# Altium project slaves.PrjPCB
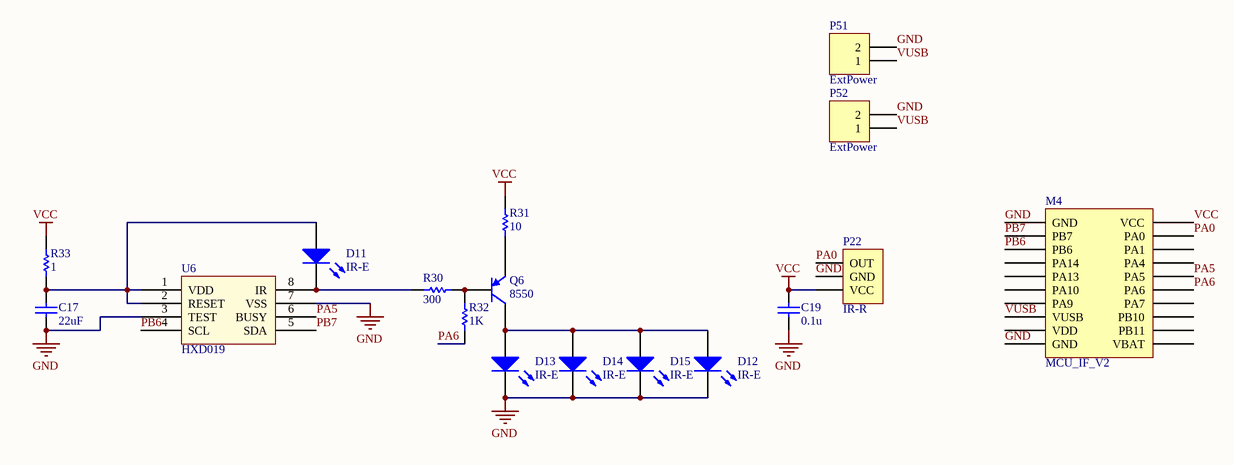
[diagram p0: IR.SchDoc]
7 sheets, 71 parts. Net scope: global (net labels, ports and power ports of the same name join across sheets).
Board file: slaves.PcbDoc
Sheets:
  IR.SchDoc
  sensors.SchDoc
  relay.SchDoc
  battery.SchDoc
  debug.SchDoc
  gp2y1010.SchDoc
  rs485.SchDoc

## Sheet IR.SchDoc
size A4

### Parts
C17  value 22uF  [C-2012[0805]]  (hidden comment: Cap Semi)
C19  value 0.1u  [C-1608[0603]]  (hidden comment: Cap Semi)
D11  IR-E  [PIN2]
D12  IR-E  [PIN2]
D13  IR-E  [PIN2]
D14  IR-E  [PIN2]
D15  IR-E  [PIN2]
M4  MCU_IF_V2  [MCU_IF_V2]
P22  IR-R  [HDR1X3]
P51  ExtPower  [HDR1X2H]
P52  ExtPower  [HDR1X2H]
Q6  8550  [SOT-23B]
R30  value 300  [R-1608[0603]]  (hidden comment: Res Semi)
R31  value 10  [R-2012[0805]]  (hidden comment: Res Semi)
R32  value 1K  [R-1608[0603]]  (hidden comment: Res Semi)
R33  value 1  [R-2012[0805]]  (hidden comment: Res Semi)
U6  HXD019  [SOP8]

### Nets
GND: C17.2 C19.1 D12.2(K) D13.2(K) D14.2(K) D15.2(K) M4.1(GND) M4.10(GND) P22.2(GND) P51.2 P52.2 U6.3(TEST) U6.7(VSS)
VCC: C19.2 M4.20(VCC) P22.3(VCC) R31.1 R33.1
VUSB: M4.8(VUSB) P51.1 P52.1
PA0: M4.19(PA0) P22.1(OUT)
PA5: M4.16(PA5) U6.6(BUSY)
PA6: M4.15(PA6) R32.1
PB6: M4.3(PB6) U6.4(SCL)
PB7: M4.2(PB7) U6.5(SDA)
NetC17_1: C17.1 D11.1(A) R33.2 U6.1(VDD) U6.2(RESET)
NetD11_2: D11.2(K) R30.1 U6.8(IR)
NetD12_1: D12.1(A) D13.1(A) D14.1(A) D15.1(A) Q6.1(C)
NetQ6_2: Q6.2(B) R30.2 R32.2
NetQ6_3: Q6.3(E) R31.2

Not connected (* = marked no-connect by the designer): M4 4(PA14) 5(PA13) 6(PA10) 7(PA9) 9(VDD) 11(VBAT) 12(PB11) 13(PB10) 14(PA7) 17(PA4) 18(PA1)

### Library data of the parts
C17 C19 = Cap Semi: Capacitor (Semiconductor SIM Model); Published: 8-Jun-2000; PackageReference: C1206; Publisher: Altium Limited
  C17: LatestRevisionDate: 29-May-2009; LatestRevisionNote: IPC-7351 Footprint Added.; PackageDescription: Chip Capacitor
  C19: LatestRevisionDate: 17-Jul-2002; LatestRevisionNote: Re-released for DXP Platform.
D11-D15 = LED0: Typical INFRARED GaAs LED; Published: 8-Jun-2000; LatestRevisionDate: 08-Jul-2005; LatestRevisionNote: Mech Layer 1 removed.; PackageReference: LED-0; Publisher: Altium Limited
M4 = MCU_IF_V1
P22 = IR: Header, 3-Pin; LatestRevisionDate: 17-Jul-2002; LatestRevisionNote: Re-released for DXP Platform.; Publisher: Altium Limited
P51 P52 = Header 2H: Header, 2-Pin, Right Angle; LatestRevisionDate: 17-Jul-2002; LatestRevisionNote: Re-released for DXP Platform.; Publisher: Altium Limited
Q6 = PNP: PNP Bipolar Transistor; pin to pad: 1>3 2>1 3>2; Published: 8-Jun-2000; LatestRevisionDate: 17-Jul-2002; LatestRevisionNote: Re-released for DXP Platform.; PackageReference: SOT-23B; Publisher: Altium Limited; Code_JEDEC: SOT-23
R30-R33 = Res Semi: Semiconductor Resistor; Published: 8-Jun-2000; LatestRevisionDate: 17-Jul-2002; LatestRevisionNote: Re-released for DXP Platform.; PackageReference: AXIAL-0.5; Publisher: Altium Limited

## Sheet sensors.SchDoc
size A4
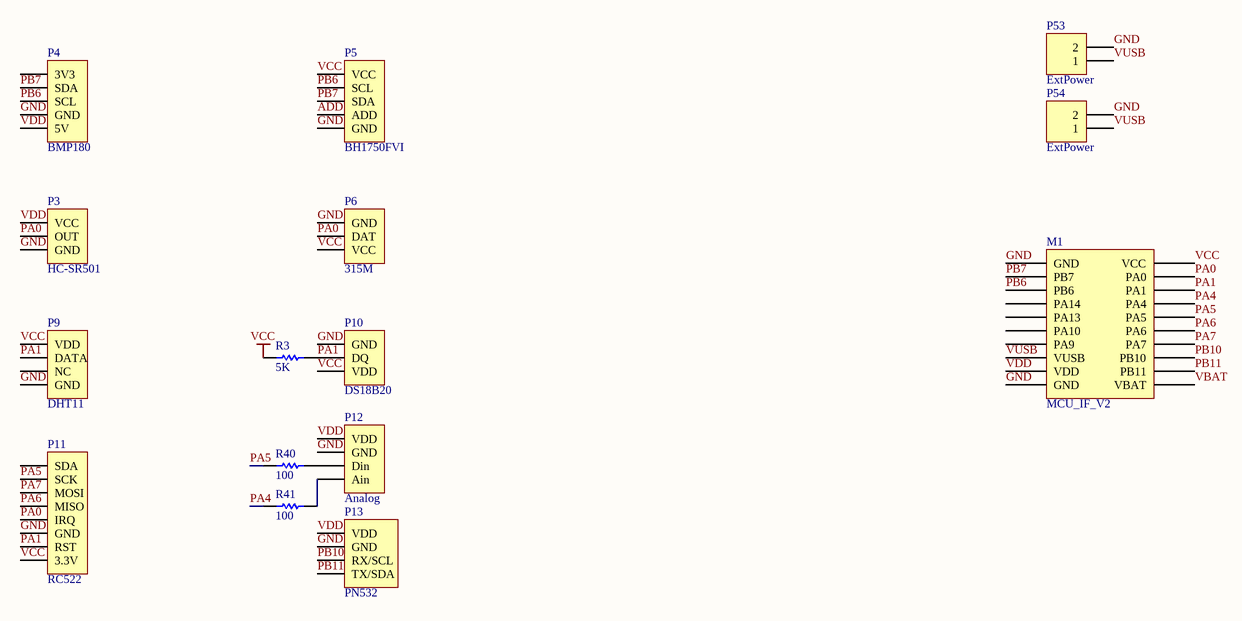
[diagram p1: sensors.SchDoc]

### Parts
M1  MCU_IF_V2  [MCU_IF_V2]
P3  HC-SR501  [HDR1X3]
P4  BMP180  [HDR1X5]
P5  BH1750FVI  [HDR1X5]
P6  315M  [HDR1X3]
P9  DHT11  [HDR1X4]
P10  DS18B20  [HDR1X3]
P11  RC522  [HDR1X8]
P12  Analog  [HDR1X4]
P13  PN532  [HDR1X4]
P53  ExtPower  [HDR1X2H]
P54  ExtPower  [HDR1X2H]
R3  value 5K  [R-1608[0603]]  (hidden comment: Res Semi)
R40  value 100  [R-1608[0603]]  (hidden comment: Res Semi)
R41  value 100  [R-1608[0603]]  (hidden comment: Res Semi)

### Nets
GND: M1.1(GND) M1.10(GND) P3.3(GND) P4.4(GND) P5.5(GND) P6.1(GND) P9.4(GND) P10.1(GND) P11.6(GND) P12.2(GND) P13.2(GND) P53.2 P54.2
VBAT: M1.11(VBAT)
VCC: M1.20(VCC) P5.1(VCC) P6.3(VCC) P9.1(VDD) P10.3(VDD) P11.8(3.3V) R3.1
VDD: M1.9(VDD) P3.1(VCC) P4.5(5V) P12.1(VDD) P13.1(VDD)
VUSB: M1.8(VUSB) P53.1 P54.1
ADD: P5.4(ADD)
PA0: M1.19(PA0) P3.2(OUT) P6.2(DAT) P11.5(IRQ)
PA1: M1.18(PA1) P9.2(DATA) P10.2(DQ) P11.7(RST) R3.2
PA4: M1.17(PA4) R41.1
PA5: M1.16(PA5) P11.2(SCK) R40.1
PA6: M1.15(PA6) P11.4(MISO)
PA7: M1.14(PA7) P11.3(MOSI)
PB6: M1.3(PB6) P4.3(SCL) P5.2(SCL)
PB7: M1.2(PB7) P4.2(SDA) P5.3(SDA)
PB10: M1.13(PB10) P13.3(RX/SCL)
PB11: M1.12(PB11) P13.4(TX/SDA)
NetP12_3: P12.3(Din) R40.2
NetP12_4: P12.4(Ain) R41.2

Not connected (* = marked no-connect by the designer): M1 4(PA14) 5(PA13) 6(PA10) 7(PA9); P4 1(3V3); P9 3(NC); P11 1(SDA)

### Library data of the parts
M1 = MCU_IF_V1
P3 = HC-SR501: Header, 3-Pin; LatestRevisionDate: 17-Jul-2002; LatestRevisionNote: Re-released for DXP Platform.; Publisher: Altium Limited
P4 = BMP180: Header, 5-Pin; LatestRevisionDate: 17-Jul-2002; LatestRevisionNote: Re-released for DXP Platform.; Publisher: Altium Limited
P6 = 315M: Header, 3-Pin; LatestRevisionDate: 17-Jul-2002; LatestRevisionNote: Re-released for DXP Platform.; Publisher: Altium Limited
P9 = DHT11: Header, 4-Pin; LatestRevisionDate: 17-Jul-2002; LatestRevisionNote: Re-released for DXP Platform.; Publisher: Altium Limited
P10 = DS18B20: Header, 3-Pin; LatestRevisionDate: 17-Jul-2002; LatestRevisionNote: Re-released for DXP Platform.; Publisher: Altium Limited
P11 = RC522: Header, 8-Pin; LatestRevisionDate: 17-Jul-2002; LatestRevisionNote: Re-released for DXP Platform.; Publisher: Altium Limited
P12 = Analog: Header, 4-Pin; LatestRevisionDate: 17-Jul-2002; LatestRevisionNote: Re-released for DXP Platform.; Publisher: Altium Limited
P13 = PN532: Header, 4-Pin; LatestRevisionDate: 17-Jul-2002; LatestRevisionNote: Re-released for DXP Platform.; Publisher: Altium Limited
P53 P54 = Header 2H: Header, 2-Pin, Right Angle; LatestRevisionDate: 17-Jul-2002; LatestRevisionNote: Re-released for DXP Platform.; Publisher: Altium Limited
R3 R40 R41 = Res Semi: Semiconductor Resistor; Published: 8-Jun-2000; LatestRevisionDate: 17-Jul-2002; LatestRevisionNote: Re-released for DXP Platform.; PackageReference: AXIAL-0.5; Publisher: Altium Limited
P5 = BH1750FVI: LatestRevisionDate: 17-Jul-2002; LatestRevisionNote: Re-released for DXP Platform.; Publisher: Altium Limited

## Sheet relay.SchDoc
size A4
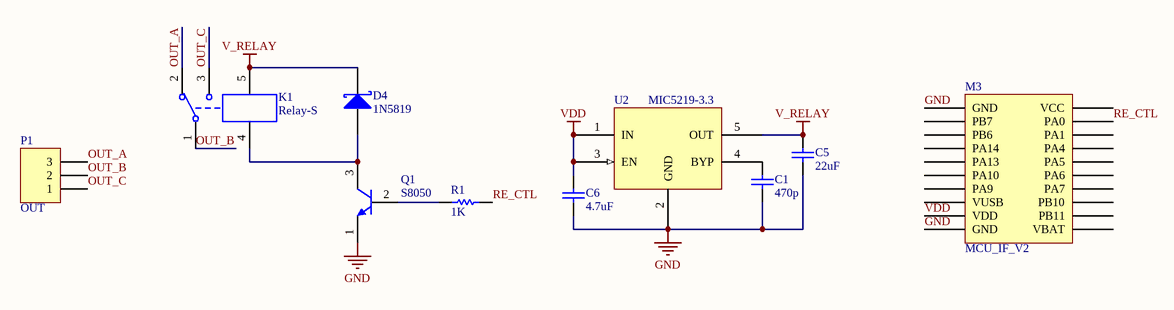
[diagram p2: relay.SchDoc]

### Parts
C1  value 470p  [C-1608[0603]]  (hidden comment: Cap Semi)
C5  value 22uF  [C-2012[0805]]  (hidden comment: Cap Semi)
C6  value 4.7uF  [C-1608[0603]]  (hidden comment: Cap Semi)
D4  1N5819  [SOD123]
K1  Relay-S  [Relay-JZC-32F-ZS]
M3  MCU_IF_V2  [MCU_IF_V2]
P1  OUT  [Edge5.08mm3P]
Q1  S8050  [SOT23B]
R1  value 1K  [R-1608[0603]]  (hidden comment: Res Semi)
U2  MIC5219-3.3  [SOT23-5]

### Nets
GND: C1.2 C5.2 C6.2 M3.1(GND) M3.10(GND) Q1.1(E) U2.2(GND)
V_RELAY: C5.1 D4.2(K) K1.5 U2.5(OUT)
VDD: C6.1 M3.9(VDD) U2.1(IN) U2.3(EN)
OUT_A: K1.2 P1.3
OUT_B: K1.1 P1.2
OUT_C: K1.3 P1.1
RE_CTL: M3.19(PA0) R1.2
NetC1_1: C1.1 U2.4(BYP)
NetD4_1: D4.1(A) K1.4 Q1.3(C)
NetQ1_2: Q1.2(B) R1.1

Not connected (* = marked no-connect by the designer): M3 2(PB7) 3(PB6) 4(PA14) 5(PA13) 6(PA10) 7(PA9) 8(VUSB) 11(VBAT) 12(PB11) 13(PB10) 14(PA7) 15(PA6) 16(PA5) 17(PA4) 18(PA1) 20(VCC)

### Library data of the parts
C1 C5 C6 = Cap Semi: Capacitor (Semiconductor SIM Model); Published: 8-Jun-2000; LatestRevisionDate: 29-May-2009; LatestRevisionNote: IPC-7351 Footprint Added.; PackageReference: C1206; Publisher: Altium Limited; PackageDescription: Chip Capacitor
D4 = D Schottky: Schottky Diode; Published: 8-Jun-2000; LatestRevisionDate: 17-Jul-2002; LatestRevisionNote: Re-released for DXP Platform.; Publisher: Altium Limited
K1 = Relay-SPDT: Single-Pole Dual-Throw Relay; Published: 24-Mar-1999; LatestRevisionDate: 17-Jul-2002; LatestRevisionNote: Re-released for DXP Platform.; PackageReference: MODULE5B; Publisher: Altium Limited
M3 = MCU_IF_V1
P1 = Header 3: Header, 3-Pin; LatestRevisionDate: 17-Jul-2002; LatestRevisionNote: Re-released for DXP Platform.; Publisher: Altium Limited
Q1 = 2N3904: NPN General Purpose Amplifier; pin to pad: 1>2 2>1; Published: 8-Jun-2000; LatestRevisionDate: 15-Jan-2003; LatestRevisionNote: PCB Footprint 'BCY-W3/D4.7' replaced; DatasheetDocument: 1997; PackageDocument: Sep-1998; PackageReference: TO-92A; Publisher: Altium Limited; Code_JEDEC: TO-92A; ComponentLink1Description: Manufacturer Link; ComponentLink1URL: http://www.fairchildsemi.com/; ComponentLink2Description: Datasheet; ComponentLink2URL: http://www.fairchildsemi.com/ds/2N%2F2N3904.pdf
R1 = Res Semi: Semiconductor Resistor; Published: 8-Jun-2000; LatestRevisionDate: 17-Jul-2002; LatestRevisionNote: Re-released for DXP Platform.; PackageReference: AXIAL-0.5; Publisher: Altium Limited
U2 = MIC5219: 500mA-Peak Output LDO Regulator

## Sheet battery.SchDoc
size A4
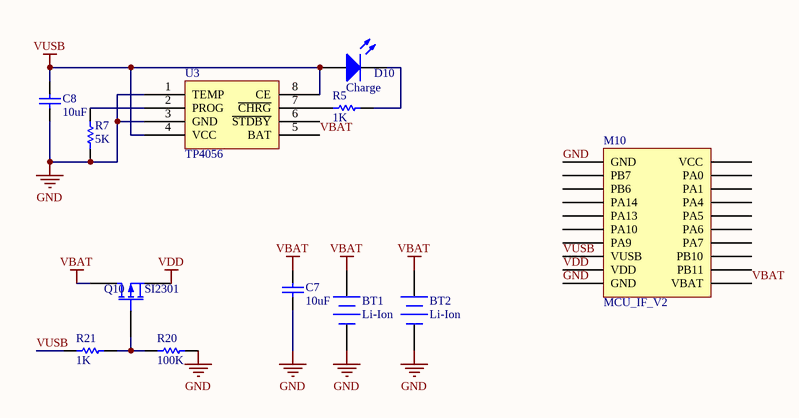
[diagram p3: battery.SchDoc]

### Parts
BT1  Li-Ion  [HDR1X2H]
BT2  Li-Ion  [Hearder2 2]
C7  value 10uF  [C-1608[0603]]  (hidden comment: Cap Semi)
C8  value 10uF  [C-1608[0603]]  (hidden comment: Cap Semi)
D10  Charge  [LED-1608[0603]-R]
M10  MCU_IF_V2  [MCU_IF_V2]
Q10  SI2301  [SOT23B]
R5  value 1K  [R-1608[0603]]  (hidden comment: Res Semi)
R7  value 5K  [R-1608[0603]]  (hidden comment: Res Semi)
R20  value 100K  [R-1608[0603]]  (hidden comment: Res Semi)
R21  value 1K  [R-1608[0603]]  (hidden comment: Res Semi)
U3  TP4056  [TP4056]

### Nets
GND: BT1.2(-) BT2.2(-) C7.1 C8.1 M10.1(GND) M10.10(GND) R7.1 R20.2 U3.1(TEMP) U3.3(GND)
VBAT: BT1.1(+) BT2.1(+) C7.2 M10.11(VBAT) Q10.1(D) U3.5(BAT)
VDD: M10.9(VDD) Q10.3(S)
VUSB: C8.2 D10.1(A) M10.8(VUSB) R21.1 U3.4(VCC) U3.8(CE)
NetD10_2: D10.2(K) R5.1
NetQ10_2: Q10.2(G) R20.1 R21.2
NetR5_2: R5.2 U3.7(~{CHRG})
NetR7_2: R7.2 U3.2(PROG)

Not connected (* = marked no-connect by the designer): M10 2(PB7) 3(PB6) 4(PA14) 5(PA13) 6(PA10) 7(PA9) 12(PB11) 13(PB10) 14(PA7) 15(PA6) 16(PA5) 17(PA4) 18(PA1) 19(PA0) 20(VCC); U3 6(~{STDBY})

### Library data of the parts
BT1 BT2 = Battery: Multicell Battery; Published: 24-Mar-1999; LatestRevisionDate: 17-Jul-2002; LatestRevisionNote: Re-released for DXP Platform.; PackageReference: BAT-2; Publisher: Altium Limited
C7 C8 = Cap Semi: Capacitor (Semiconductor SIM Model); Published: 8-Jun-2000; LatestRevisionDate: 17-Jul-2002; LatestRevisionNote: Re-released for DXP Platform.; PackageReference: C1206; Publisher: Altium Limited
D10 = LED2: Typical RED, GREEN, YELLOW, AMBER GaAs LED; Published: 8-Jun-2000; LatestRevisionDate: 17-Jul-2002; LatestRevisionNote: Re-released for DXP Platform.; PackageDocument: Feb-2002; PackageReference: 3.2X1.6X1.1; Publisher: Altium Limited
M10 = MCU_IF_V1
Q10 = MOSFET-P: P-Channel MOSFET; pin to pad: 1>3 2>1 3>2; PackageDocument: 1995/1996; Published: 8-Jun-2000; LatestRevisionDate: 17-Jul-2002; LatestRevisionNote: Re-released for DXP Platform.; PackageReference: E3; Publisher: Altium Limited
R5 R7 R20 R21 = Res Semi: Semiconductor Resistor; Published: 8-Jun-2000; LatestRevisionDate: 17-Jul-2002; LatestRevisionNote: Re-released for DXP Platform.; PackageReference: AXIAL-0.5; Publisher: Altium Limited

## Sheet debug.SchDoc
size A4
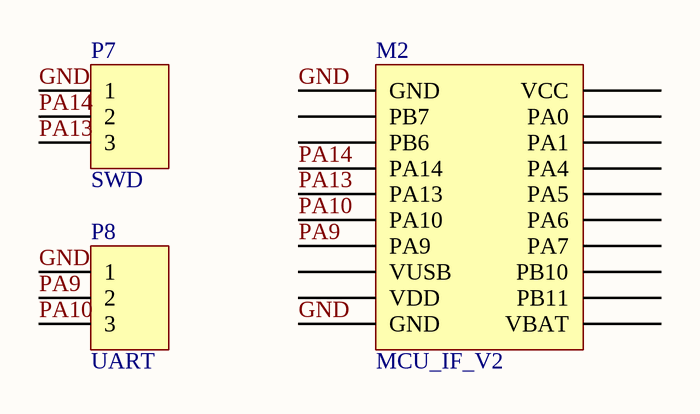
[diagram p4: debug.SchDoc]

### Parts
M2  MCU_IF_V2  [MCU_IF_V2]
P7  SWD  [EDGE_3_2.54]
P8  UART  [EDGE_3_2.54]

### Nets
GND: M2.1(GND) M2.10(GND) P7.1 P8.1
PA9: M2.7(PA9) P8.2
PA10: M2.6(PA10) P8.3
PA13: M2.5(PA13) P7.3
PA14: M2.4(PA14) P7.2

Not connected (* = marked no-connect by the designer): M2 2(PB7) 3(PB6) 8(VUSB) 9(VDD) 11(VBAT) 12(PB11) 13(PB10) 14(PA7) 15(PA6) 16(PA5) 17(PA4) 18(PA1) 19(PA0) 20(VCC)

### Library data of the parts
M2 = MCU_IF_V1
P7 P8 = Header 3: Header, 3-Pin; LatestRevisionDate: 17-Jul-2002; LatestRevisionNote: Re-released for DXP Platform.; Publisher: Altium Limited

## Sheet gp2y1010.SchDoc
size A4
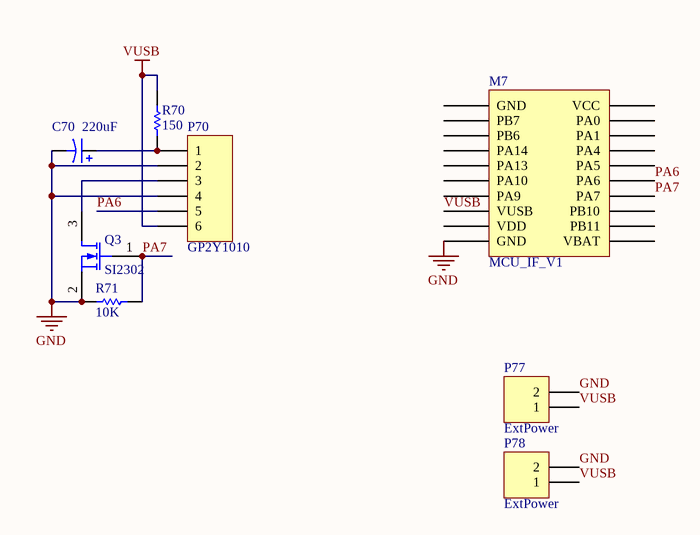
[diagram p5: gp2y1010.SchDoc]

### Parts
C70  value 220uF  [Capacitor_2.4mm_6mm]  (hidden comment: Cap Pol1)
M7  MCU_IF_V1  [MCU_IF_V2]
P70  GP2Y1010  [GP2Y1010AU0F]
P77  ExtPower  [HDR1X2H]
P78  ExtPower  [HDR1X2H]
Q3  SI2302  [SOT23B]
R70  value 150  [R-1608[0603]]  (hidden comment: Res Semi)
R71  value 10K  [R-1608[0603]]  (hidden comment: Res Semi)

### Nets
GND: C70.2 M7.10(GND) P70.2 P70.4 P77.2 P78.2 Q3.2(S) R71.2
VUSB: M7.8(VUSB) P70.6 P77.1 P78.1 R70.2
PA6: M7.15(PA6) P70.5
PA7: M7.14(PA7) Q3.1(G) R71.1
NetC70_1: C70.1 P70.1 R70.1
NetP70_3: P70.3 Q3.3(D)

Not connected (* = marked no-connect by the designer): M7 1(GND) 2(PB7) 3(PB6) 4(PA14) 5(PA13) 6(PA10) 7(PA9) 9(VDD) 11(VBAT) 12(PB11) 13(PB10) 16(PA5) 17(PA4) 18(PA1) 19(PA0) 20(VCC)

### Library data of the parts
C70 = Cap Pol1: Polarized Capacitor (Radial); Published: 8-Jun-2000; LatestRevisionDate: 17-Jul-2002; LatestRevisionNote: Re-released for DXP Platform.; PackageReference: RB7.6-15; Publisher: Altium Limited
P70 = Header 6: Header, 6-Pin; LatestRevisionDate: 17-Jul-2002; LatestRevisionNote: Re-released for DXP Platform.; Publisher: Altium Limited
P77 P78 = Header 2H: Header, 2-Pin, Right Angle; LatestRevisionDate: 17-Jul-2002; LatestRevisionNote: Re-released for DXP Platform.; Publisher: Altium Limited
Q3 = SI2302: N-Channel MOSFET; Published: 8-Jun-2000; LatestRevisionDate: 17-Jul-2002; LatestRevisionNote: Re-released for DXP Platform.; PackageVersion: 1995/1996; PackageReference: E3; Publisher: Altium Limited
R70 R71 = Res Semi: Semiconductor Resistor; Published: 8-Jun-2000; LatestRevisionDate: 17-Jul-2002; LatestRevisionNote: Re-released for DXP Platform.; PackageReference: AXIAL-0.5; Publisher: Altium Limited; PackageDescription: Axial Device, Thru-Hole; 2 Leads; 0.5 in Pin Spacing

## Sheet rs485.SchDoc
size A4
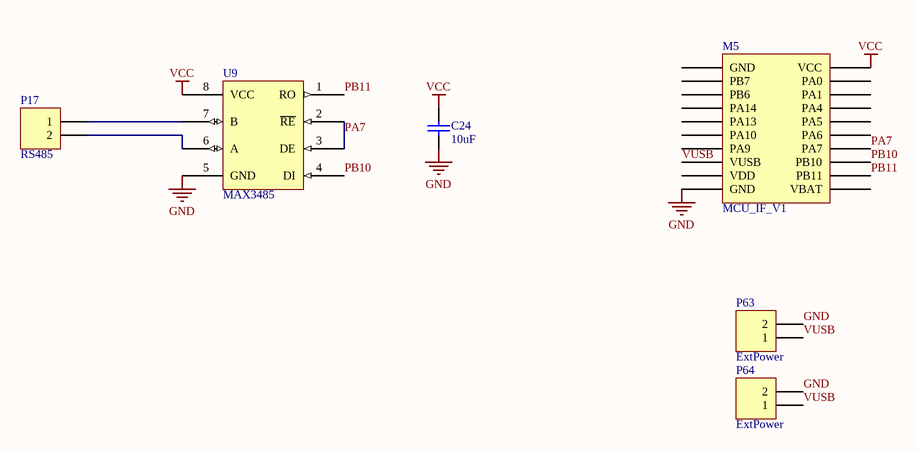
[diagram p6: rs485.SchDoc]

### Parts
C24  value 10uF  [C-2012[0805]]  (hidden comment: Cap Semi)
M5  MCU_IF_V1  [MCU_IF_V2]
P17  RS485  [Edge5.08mm2P]
P63  ExtPower  [HDR1X2H]
P64  ExtPower  [HDR1X2H]
U9  MAX3485  [SOP8]

### Nets
GND: C24.2 M5.10(GND) P63.2 P64.2 U9.5(GND)
VCC: C24.1 M5.20(VCC) U9.8(VCC)
VUSB: M5.8(VUSB) P63.1 P64.1
PA7: M5.14(PA7) U9.2(~{RE}) U9.3(DE)
PB10: M5.13(PB10) U9.4(DI)
PB11: M5.12(PB11) U9.1(RO)
NetP17_1: P17.1 U9.7(B)
NetP17_2: P17.2 U9.6(A)

Not connected (* = marked no-connect by the designer): M5 1(GND) 2(PB7) 3(PB6) 4(PA14) 5(PA13) 6(PA10) 7(PA9) 9(VDD) 11(VBAT) 15(PA6) 16(PA5) 17(PA4) 18(PA1) 19(PA0)

### Library data of the parts
C24 = Cap Semi: Capacitor (Semiconductor SIM Model); Published: 8-Jun-2000; LatestRevisionDate: 29-May-2009; LatestRevisionNote: IPC-7351 Footprint Added.; PackageReference: C1206; Publisher: Altium Limited; PackageDescription: Chip Capacitor
P17 = Header 2: Header, 2-Pin; LatestRevisionDate: 17-Jul-2002; LatestRevisionNote: Re-released for DXP Platform.; Publisher: Altium Limited
P63 P64 = Header 2H: Header, 2-Pin, Right Angle; LatestRevisionDate: 17-Jul-2002; LatestRevisionNote: Re-released for DXP Platform.; Publisher: Altium Limited

## Nets that join several sheets
GND: IR (13 pins), sensors (13 pins), relay (7 pins), battery (10 pins), debug (M2.1 M2.10 P7.1 P8.1), gp2y1010 (8 pins), rs485 (5 pins)
VBAT: sensors (M1.11), battery (6 pins)
VCC: IR (5 pins), sensors (7 pins), rs485 (C24.1 M5.20 U9.8)
VDD: sensors (5 pins), relay (C6.1 M3.9 U2.1 U2.3), battery (M10.9 Q10.3)
VUSB: IR (M4.8 P51.1 P52.1), sensors (M1.8 P53.1 P54.1), battery (6 pins), gp2y1010 (5 pins), rs485 (M5.8 P63.1 P64.1)
PA0: IR (M4.19 P22.1), sensors (M1.19 P3.2 P6.2 P11.5)
PA5: IR (M4.16 U6.6), sensors (M1.16 P11.2 R40.1)
PA6: IR (M4.15 R32.1), sensors (M1.15 P11.4), gp2y1010 (M7.15 P70.5)
PA7: sensors (M1.14 P11.3), gp2y1010 (M7.14 Q3.1 R71.1), rs485 (M5.14 U9.2 U9.3)
PB6: IR (M4.3 U6.4), sensors (M1.3 P4.3 P5.2)
PB7: IR (M4.2 U6.5), sensors (M1.2 P4.2 P5.3)
PB10: sensors (M1.13 P13.3), rs485 (M5.13 U9.4)
PB11: sensors (M1.12 P13.4), rs485 (M5.12 U9.1)